# Altium project DIP2040.PrjPcb
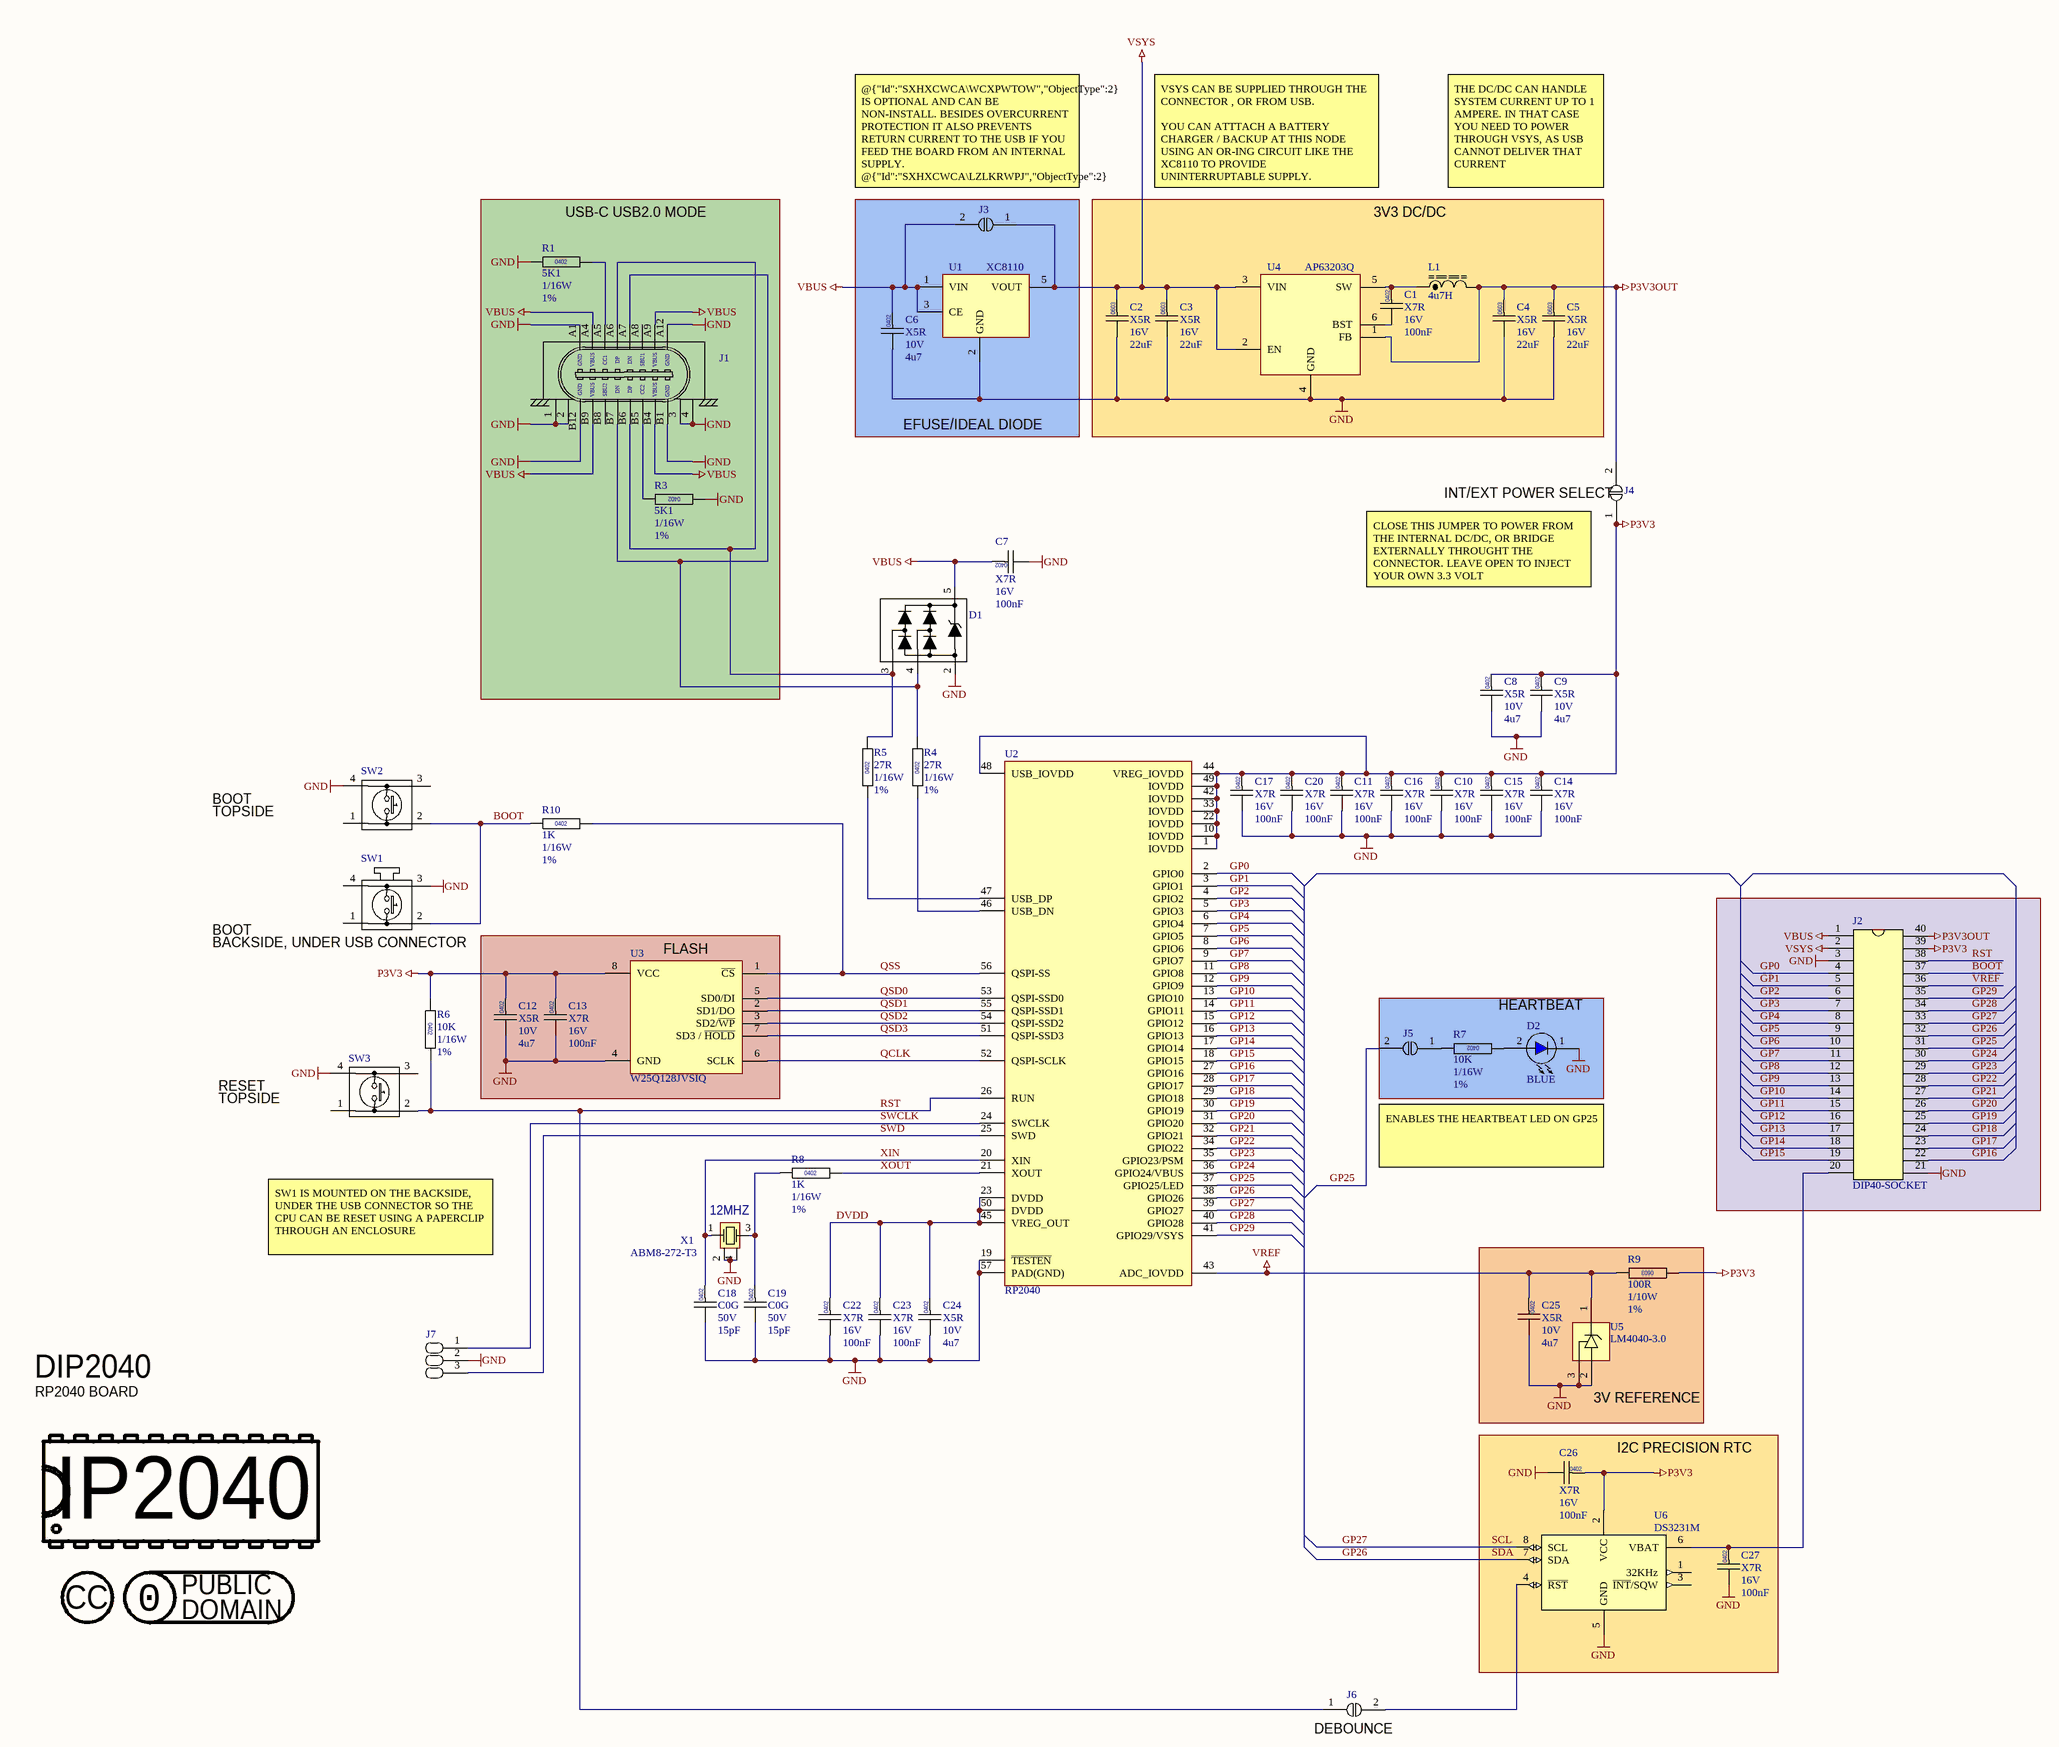
[diagram p0: DIP2040.SchDoc]
1 sheet, 57 parts. Net scope: global (net labels, ports and power ports of the same name join across sheets).
Board file: DIP2040.PcbDoc

## Sheet DIP2040.SchDoc
size C; SheetNumber: 1; SheetTotal: 1

### Parts
C1  Dielectric: X7R  Voltage: 16V  Capacitance: 100nF  [CAPC0402]  (hidden comment: CAP0402)
C2  Dielectric: X5R  Voltage: 16V  Capacitance: 22uF  [CAPC0603]  (hidden comment: CAP0603)
C3  Dielectric: X5R  Voltage: 16V  Capacitance: 22uF  [CAPC0603]  (hidden comment: CAP0603)
C4  Dielectric: X5R  Voltage: 16V  Capacitance: 22uF  [CAPC0603]  (hidden comment: CAP0603)
C5  Dielectric: X5R  Voltage: 16V  Capacitance: 22uF  [CAPC0603]  (hidden comment: CAP0603)
C6  Dielectric: X5R  Voltage: 10V  Capacitance: 4u7  [CAPC0402]  (hidden comment: CAP0402)
C7  Dielectric: X7R  Voltage: 16V  Capacitance: 100nF  [CAPC0402]  (hidden comment: CAP0402)
C8  Dielectric: X5R  Voltage: 10V  Capacitance: 4u7  [CAPC0402]  (hidden comment: CAP0402)
C9  Dielectric: X5R  Voltage: 10V  Capacitance: 4u7  [CAPC0402]  (hidden comment: CAP0402)
C10  Dielectric: X7R  Voltage: 16V  Capacitance: 100nF  [CAPC0402]  (hidden comment: CAP0402)
C11  Dielectric: X7R  Voltage: 16V  Capacitance: 100nF  [CAPC0402]  (hidden comment: CAP0402)
C12  Dielectric: X5R  Voltage: 10V  Capacitance: 4u7  [CAPC0402]  (hidden comment: CAP0402)
C13  Dielectric: X7R  Voltage: 16V  Capacitance: 100nF  [CAPC0402]  (hidden comment: CAP0402)
C14  Dielectric: X7R  Voltage: 16V  Capacitance: 100nF  [CAPC0402]  (hidden comment: CAP0402)
C15  Dielectric: X7R  Voltage: 16V  Capacitance: 100nF  [CAPC0402]  (hidden comment: CAP0402)
C16  Dielectric: X7R  Voltage: 16V  Capacitance: 100nF  [CAPC0402]  (hidden comment: CAP0402)
C17  Dielectric: X7R  Voltage: 16V  Capacitance: 100nF  [CAPC0402]  (hidden comment: CAP0402)
C18  Dielectric: C0G  Voltage: 50V  Capacitance: 15pF  [CAPC0402]  (hidden comment: CAP0603)
C19  Dielectric: C0G  Voltage: 50V  Capacitance: 15pF  [CAPC0402]  (hidden comment: CAP0603)
C20  Dielectric: X7R  Voltage: 16V  Capacitance: 100nF  [CAPC0402]  (hidden comment: CAP0402)
C22  Dielectric: X7R  Voltage: 16V  Capacitance: 100nF  [CAPC0402]  (hidden comment: CAP0402)
C23  Dielectric: X7R  Voltage: 16V  Capacitance: 100nF  [CAPC0402]  (hidden comment: CAP0402)
C24  Dielectric: X5R  Voltage: 10V  Capacitance: 4u7  [CAPC0402]  (hidden comment: CAP0402)
C25  Dielectric: X5R  Voltage: 10V  Capacitance: 4u7  [CAPC0402]  (hidden comment: CAP0402)
C26  Dielectric: X7R  Voltage: 16V  Capacitance: 100nF  [CAPC0402]  (hidden comment: CAP0402)
C27  Dielectric: X7R  Voltage: 16V  Capacitance: 100nF  [CAPC0402]  (hidden comment: CAP0402)
D1  TVS-WURTH-824011  [SOT23-5]  (value not drawn)
D2  BLUE  [LED-0603-BLUE]
J1  CONN-USBC-USB2-HOR  [CONN-GCT-USB4085]  (value not drawn)
J2  DIP40-SOCKET  [CONN-DIP40-SOCKET]
J3  SOLDERPAD-2  [SOLDERPAD-2]  (value not drawn)  (no BOM)
J4  SOLDERPAD-2  [SOLDERPAD-2]  (value not drawn)  (no BOM)
J5  SOLDERPAD-2  [SOLDERPAD-2]  (value not drawn)  (no BOM)
J6  SOLDERPAD-2  [SOLDERPAD-2]  (value not drawn)  (no BOM)
J7  CONN-TESTPAD-1.5X1-2MMP-3  [CONN-TESTPAD-1.5X1-2MMP-3]  (value not drawn)  (no BOM)
L1  value 4u7H  [IND-ABRACON-ASPI-3012S-3R9N-T]  (hidden comment: 4.7uH)
LOGO1  LOGO-LICENSE-CC0-PUBLIC  [LOGO-LICENSE-CC0-PUBLIC]  (value not drawn)  (no BOM)
LOGO2  LOGO-LICENSE-CC  [LOGO-LICENSE-CC]  (value not drawn)  (no BOM)
R1  value 5K1  Power: 1/16W  Tolerance: 1%  [RESC0402]  (hidden comment: RESC0402)
R3  value 5K1  Power: 1/16W  Tolerance: 1%  [RESC0402]  (hidden comment: RESC0402)
R4  value 27R  Power: 1/16W  Tolerance: 1%  [RESC0402]  (hidden comment: RESC0402)
R5  value 27R  Power: 1/16W  Tolerance: 1%  [RESC0402]  (hidden comment: RESC0402)
R6  value 10K  Power: 1/16W  Tolerance: 1%  [RESC0402]  (hidden comment: RESC0402)
R7  value 10K  Power: 1/16W  Tolerance: 1%  [RESC0402]  (hidden comment: RESC0402)
R8  value 1K  Power: 1/16W  Tolerance: 1%  [RESC0402]  (hidden comment: RESC0402)
R9  value 100R  Power: 1/10W  Tolerance: 1%  [RES0603]  (hidden comment: RESC0603)
R10  value 1K  Power: 1/16W  Tolerance: 1%  [RESC0402]  (hidden comment: RESC0402)
SW1  SWITCH-E-SWITCH-TL1016  [SWITCH-ESWITCH-TL1016]  (value not drawn)
SW2  SWITCH-PANASONIC-EVP-AA202K  [SWITCH-PANASONIC-EVP-AA202K]  (value not drawn)
SW3  SWITCH-PANASONIC-EVP-AA202K  [SWITCH-PANASONIC-EVP-AA202K]  (value not drawn)
U1  XC8110  [SOT23-5]
U2  RP2040  [QFN40P700X700X90-56N-TH310X310]
U3  W25Q128JVSIQ  [SO127P790-8N]
U4  AP63203Q  [SOT23-6]
U5  LM4040-3.0  [SOT23]
U6  DS3231M  [SO127P600-8N]
X1  ABM8-272-T3  [XTAL-ABRACON-ABM8-272-T3]

### Blocks framed on the sheet
USB-C USB2.0 MODE: J1 R1 R3
EFUSE/IDEAL DIODE: C6 J3 U1
3V3 DC/DC: C1-C5 L1 U4
FLASH: C12 C13 U3
HEARTBEAT: D2 J5 R7
3V REFERENCE: C25 R9 U5
I2C PRECISION RTC: C26 C27 U6

### Nets
GND: C2.2 C3.2 C4.2 C5.2 C6.2 C7.2 C8.2 C9.2 C10.2 C11.2 C12.2 C13.2 C14.2 C15.2 C16.2 C17.2 C18.2 C19.2 C20.2 C22.2 C23.2 C24.2 C25.2 C26.2 C27.2 D1.2(A) D2.1(A) J1.1 J1.2 J1.3 J1.4 J1.A1 J1.A12 J1.B1 J1.B12 J2.3 J2.21 J7.2 R1.2 R3.2 SW1.3 SW2.4 SW3.4 U1.2(GND) U2.19(~{TESTEN}) U2.57(PAD(GND)) U3.4(GND) U4.4(GND) U5.2 U5.3 U6.5(GND) X1.2 X1.4
P3V3: C8.1 C9.1 C10.1 C11.1 C12.1 C13.1 C14.1 C15.1 C16.1 C17.1 C20.1 C26.1 J2.39 J4.1 R6.2 R9.2 U2.1(IOVDD) U2.10(IOVDD) U2.22(IOVDD) U2.33(IOVDD) U2.42(IOVDD) U2.44(VREG_IOVDD) U2.48(USB_IOVDD) U2.49(IOVDD) U3.8(VCC) U6.2(VCC)
P3V3OUT: C4.1 C5.1 J2.40 J4.2 L1.2 U4.1(FB)
VBUS: C6.1 C7.1 D1.5(A) J1.A4 J1.A9 J1.B4 J1.B9 J2.1 J3.2 U1.1(VIN) U1.3(CE)
VREF: C25.1 J2.36 R9.1 U2.43(ADC_IOVDD) U5.1
VSYS: C2.1 C3.1 J2.2 J3.1 U1.5(VOUT) U4.2(EN) U4.3(VIN)
BOOT: J2.37 R10.1 SW1.2 SW2.2
DVDD: C22.1 C23.1 C24.1 U2.23(DVDD) U2.45(VREG_OUT) U2.50(DVDD)
GP0: J2.4 U2.2(GPIO0)
GP1: J2.5 U2.3(GPIO1)
GP2: J2.6 U2.4(GPIO2)
GP3: J2.7 U2.5(GPIO3)
GP4: J2.8 U2.6(GPIO4)
GP5: J2.9 U2.7(GPIO5)
GP6: J2.10 U2.8(GPIO6)
GP7: J2.11 U2.9(GPIO7)
GP8: J2.12 U2.11(GPIO8)
GP9: J2.13 U2.12(GPIO9)
GP10: J2.14 U2.13(GPIO10)
GP11: J2.15 U2.14(GPIO11)
GP12: J2.16 U2.15(GPIO12)
GP13: J2.17 U2.16(GPIO13)
GP14: J2.18 U2.17(GPIO14)
GP15: J2.19 U2.18(GPIO15)
GP16: J2.22 U2.27(GPIO16)
GP17: J2.23 U2.28(GPIO17)
GP18: J2.24 U2.29(GPIO18)
GP19: J2.25 U2.30(GPIO19)
GP20: J2.26 U2.31(GPIO20)
GP21: J2.27 U2.32(GPIO21)
GP22: J2.28 U2.34(GPIO22)
GP23: J2.29 U2.35(GPIO23/PSM)
GP24: J2.30 U2.36(GPIO24/VBUS)
GP25: J2.31 J5.2 U2.37(GPIO25/LED)
GP26: J2.32 U2.38(GPIO26) U6.7(SDA)  [also labelled SDA]
GP27: J2.33 U2.39(GPIO27) U6.8(SCL)  [also labelled SCL]
GP28: J2.34 U2.40(GPIO28)
GP29: J2.35 U2.41(GPIO29/VSYS)
QCLK: U2.52(QSPI-SCLK) U3.6(SCLK)
QSD0: U2.53(QSPI-SSD0) U3.5(SD0/DI)
QSD1: U2.55(QSPI-SSD1) U3.2(SD1/DO)
QSD2: U2.54(QSPI-SSD2) U3.3(SD2/~{WP})
QSD3: U2.51(QSPI-SSD3) U3.7(SD3_/_~{HOLD})
QSS: R10.2 U2.56(QSPI-SS) U3.1(~{CS})
RST: J2.38 J6.1 R6.1 SW3.2 U2.26(RUN)
SWCLK: J7.1 U2.24(SWCLK)
SWD: J7.3 U2.25(SWD)
XIN: C18.1 U2.20(XIN) X1.1
XOUT: R8.2 U2.21(XOUT)
NetC1_1: C1.1 L1.1 U4.5(SW)
NetC1_2: C1.2 U4.6(BST)
NetC19_1: C19.1 R8.1 X1.3
NetC27_1: C27.1 J2.20 U6.6(VBAT)
NetD1_3: D1.3(A) J1.A6 J1.B6 R5.1
NetD1_4: D1.4(A) J1.A7 J1.B7 R4.1
NetD2_2: D2.2(K) R7.2
NetJ1_A5: J1.A5 R1.1
NetJ1_B5: J1.B5 R3.1
NetJ5_1: J5.1 R7.1
NetJ6_2: J6.2 U6.4(~{RST})
NetR4_2: R4.2 U2.46(USB_DN)
NetR5_2: R5.2 U2.47(USB_DP)

Not connected (* = marked no-connect by the designer): J1 A8 B8; SW1 1 4; SW2 1 3; SW3 1 3; U6 1(32KHz) 3(~{INT}/SQW)

### Notes on the sheet
- (near J3) @{"Id":"SXHXCWCA\WCXPWTOW","ObjectType":2} IS OPTIONAL AND CAN BE NON-INSTALL. BESIDES OVERCURRENT PROTECTION IT ALSO PREVENTS RETURN CURRENT TO THE USB IF YOU FEED THE BOARD FROM AN INTERNAL SUPPLY.
  @{"Id":"SXHXCWCA\LZLKRWPJ","ObjectType":2} 8 CAN BE CLOSED IF @{"Id":"SXHXCWCA\WCXPWTOW","ObjectType":2} IS NON-INSTALL
- VSYS CAN BE SUPPLIED THROUGH THE CONNECTOR , OR FROM USB.
  YOU CAN ATTTACH A BATTERY CHARGER / BACKUP AT THIS NODE USING AN OR-ING CIRCUIT LIKE THE XC8110 TO PROVIDE UNINTERRUPTABLE SUPPLY.
- THE DC/DC CAN HANDLE SYSTEM CURRENT UP TO 1 AMPERE. IN THAT CASE YOU NEED TO POWER THROUGH VSYS, AS USB CANNOT DELIVER THAT CURRENT
- (near J4) INT/EXT POWER SELECT
- (near J4) CLOSE THIS JUMPER TO POWER FROM THE INTERNAL DC/DC, OR BRIDGE EXTERNALLY THROUGHT THE CONNECTOR. LEAVE OPEN TO INJECT YOUR OWN 3.3 VOLT
- BOOT
- TOPSIDE
- (near SW1) BACKSIDE, UNDER USB CONNECTOR
- RESET
- (near X1) 12MHZ
- ENABLES THE HEARTBEAT LED ON GP25
- SW1 IS MOUNTED ON THE BACKSIDE, UNDER THE USB CONNECTOR SO THE CPU CAN BE RESET USING A PAPERCLIP THROUGH AN ENCLOSURE
- RP2040 BOARD
- DIP2040
- IP2040
- (near J6) DEBOUNCE
- (in symbol CAPC-0402-4u7-10V-X5R) 0402
- (in symbol CONN-USBC-USB2-HOR) GND; VBUS; CC1; DP; DN; SBU1; SBU2; CC2
- (in symbol LOGO-LICENSE-CC) CC
- (in symbol LOGO-LICENSE-CC0-PUBLIC) PUBLIC; 0; DOMAIN
- (in symbol RESC-0402-1K-1%-1/10W) 0402
- (in symbol RESC-0402-5K1-1%-1/10W) 0402
- (in symbol RESC-0402-10K-1%-1/10W) 0402
- (in symbol RESC-0402-27R-1%-1/10W) 0402
- (in symbol RESC-0603-100R-1%-1/10W) 0603

### Library data of the parts
C1 C7 C10 C11 C13-C17 C20 C22 C23 C26 C27 = CAPC-0402-100nF-16V-X7R: CAPACITOR,CERAMIC,100nF,16V,X7R,0402; Package / Case: 0402; Location: *; Supplier 1: Digikey; Supplier Part Number 1: 1292-1630-1-ND; LCSC: C60474
C2-C5 = CAPC-0603-22uF-16V-X5R: CAPACITOR,CERAMIC,22uF,16V,X5R,0603; Package / Case: 0603; Location: *; Supplier 1: Digikey; Supplier Part Number 1: 1276-7076-1-ND; LCSC: C2762594
C6 C8 C9 C12 C24 C25 = CAPC-0402-4u7-10V-X5R: CAPACITOR,CERAMIC,4u7,10V,X5R,0402; Package / Case: 0603; Location: *; Supplier 1: Digikey; Supplier Part Number 1: 1276-1482-1-ND; LCSC: C1705
C18 C19 = CAPC-0402-15PF-50V-C0G: CAPACITOR,CERAMIC,15pF,50V,C0G,0402; Package / Case: 0402; Location: *; Supplier 1: Digikey; Supplier Part Number 1: 311-3780-1-ND; LCSC: C3906764
D1 = TVS-WURTH-824011: DIODE,TVS,DUAL,UNIDIRECTIONAL,USB; Supplier 1: Digikey; Supplier Part Number 1: 732-4465-1-ND; LCSC: C22358704
D2 = LED-WURTH-150060BS75000: LED,BLUE,0603; LCSC: C965807; Supplier 1: Digikey; Supplier Part Number 1: 732-4966-1-ND
J1 = CONN-USBC-USB2-HOR: USB-C, RIGHT ANGLE
L1 = IND-TAIYO-NRH3012T4R7MN: IND,4.7uH,1.06A,3X3, NRH3012T4R7MN; LCSC: C5159666, C42429096; Supplier 1: Digikey; Supplier Part Number 1: 587-2591-1-ND
R1 R3 = RESC-0402-5K1-1%-1/10W: RESISTOR,5K1,1%,63mW,0402 (1005); Location: *; LCSC: C105872; Supplier 1: Future Electronics; Supplier Part Number 1: 6053649
R4 R5 = RESC-0402-27R-1%-1/10W: RESISTOR,27R,1%,63mW,0402 (1005); Location: *; Supplier 1: Future Electronics; Supplier Part Number 1: 2577120; LCSC: C138021
R6 R7 = RESC-0402-10K-1%-1/10W: RESISTOR,10K,1%,63mW,0402 (1005); Location: *; LCSC: C60490; Supplier 1: Future Electronics; Supplier Part Number 1: 3388022
R8 R10 = RESC-0402-1K-1%-1/10W: RESISTOR,1K,1%,63mW,0402 (1005); Location: *; LCSC: C106235; Supplier 1: Future Electronics; Supplier Part Number 1: 7825607
R9 = RESC-0603-100R-1%-1/10W: RESISTOR,100R,1%,100mW,0603 (1608); Location: *
U1 = IC-TOREX-XC8110: IC,PMIC,IDEAL DIODE ORING CONTROLLER; Parameter 1: TOREX
U2 = IC-RPI-RP2040-DIP40
U3 = IC-WINBOND-W25Q128JVSIQ: IC,FLASH,QSPI,16Mx8; Supplier 1: Digikey; Supplier Part Number 1: W25Q128JVSIQCT-ND; LCSC: C97521
U4 = IC-DIODES-AP63203Q: IC,PMIC,STEP-DOWN, 2A 3.3V; Supplier 1: Digikey; Supplier Part Number 1: 31-AP63203QWU-7CT-ND; LCSC: C780769
U5 = IC-TI-LM4040-3: IC,VOLTAGE REFERENCE,3.0V; Supplier 1: Mouser; Supplier Part Number 1: 926-LM4040AIM330NOPB; LCSC: C460608
U6 = IC-ANALOG-DS3231M: IC,RTC,I2C,DS3231M; Supplier 1: Mouser; Supplier Part Number 1: 700-DS3231MZ+TRL; LCSC: C107410
X1 = XTAL-ABRACON-ABM8-272-T3: XTAL,12MHZ,RP2350; Supplier 1: Mouser; Supplier Part Number 1: 815-ABM8-272-T3; LCSC: C20625731